# Altium schematic sheet CAN_PHY.SchDoc
size A3; Organization: Altium Limited; Address1: L3, 12a Rodborough Rd; Address2: Frenchs Forest; Address3: NSW; Address4: Australia 2086
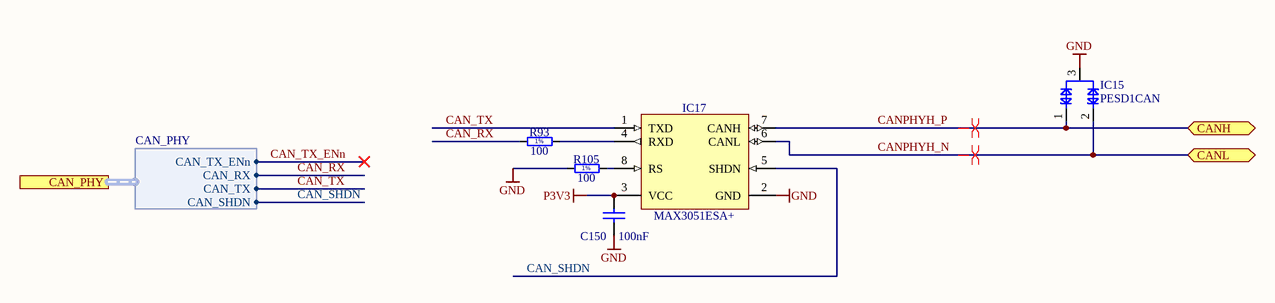
[diagram p0: CAN_PHY.SchDoc]

## Parts
C150  100nF  [CAPC1005X55N]
IC15  PESD1CAN  [SOT-23]
IC17  MAX3051ESA+  [SOIC127P600X175-8N]
R93  100  [RESC1005X40N]
R105  100  [RESC1005X40N]

## Ports
CAN_PHY (harness CAN_PHY), CANH (bidir), CANL (bidir)

## Harnesses
CAN_PHY: CAN_TX, CAN_RX, CAN_TX_ENn, CAN_SHDN

## Nets
GND: C150.1 IC15.3 IC17.2(GND) R105.1
P3V3: C150.2 IC17.3(VCC)
CAN_RX: R93.1 ; port CAN_PHY.CAN_RX
CAN_SHDN: IC17.5(SHDN) ; port CAN_PHY.CAN_SHDN
CAN_TX: IC17.1(TXD) ; port CAN_PHY.CAN_TX
CAN_TX_ENn: port CAN_PHY.CAN_TX_ENn
CANPHYH_N: IC15.2 IC17.6(CANL) ; port CANL
CANPHYH_P: IC15.1 IC17.7(CANH) ; port CANH
NetIC17_4: IC17.4(RXD) R93.2
NetIC17_8: IC17.8(RS) R105.2

## Layout directives
differential pair: CANPHYH_N, CANPHYH_P

## Notes on the sheet
- Title
- Size:
- Date:
- A3
- Number:
- Time:
- Revision:
- Sheet
- of
- File:
- (in symbol R0402_100R_1%_0.0625W_100PPM) 1%

## Library data of the parts
C150 = CC0402_100NF_16V_10%_X7R: Non-polarised capacitor; Part Description: SMD Multilayer Chip Ceramic Capacitor; Manufacturer: GENERIC; Manufacturer1 Part Number: GRM155R71C104KA88D; Voltage: 16V; TC: X7R; Tolerance: ±10%; Part Number: CC0402_100NF_16V_10%_X7R; Component Kind: Standard; Component Type: Standard; Pin Count: 2; Value: 100nF; Status: Not Recommended; Manufacturer Part Number: CC0402_100NF_16V_10%_X7R; Case: 0402; Mounted: Yes; Socket: No; SMD: Yes; Manufacturer1 Example: MURATA; Manufacturer1 ComponentHeight: 0.55mm; HelpURL: \\cern.ch\dfs\Applications\Altium\Datasheets\CC0402_X7R_MURATA_GRM.pdf; Author: CERN DEM JLC; CreateDate: 2013-12-05; LatestRevisionDate: 2007-12-03; Sense: No
IC15 = D_TVS_PESD1CAN: Dual 24V ESD transient voltage suppressor
IC17 = MAX3051ESA+: +3.3V, 1Mbps, Low-Supply-Current CAN Transceiver; Manufacturer: MAXIM; PressFit: No; Bonding: No; Part Number: MAX3051ESA+; Component Kind: Standard; Component Type: Standard; Device: MAX3051ESA+; PackageDescription: SOIC 8, Pitch 1.27mm - Body 4x5mm, IPC Medium Density; Part Description: +3.3V, 1Mbps, Low-Supply-Current CAN Transceiver; Manufacturer Part Number: MAX3051ESA+; Pin Count: 8; Case: SOIC8; Mounted: Yes; Socket: No; SMD: Yes; Sense: No; ComponentHeight: 1.75mm; Author: CERN DEM JLC; HelpURL: \\cern.ch\dfs\Applications\Altium\Datasheets\MAX3051ESA+.pdf; CreateDate: 2014-10-09; LatestRevisionDate: 2014-10-09
R93 R105 = R0402_100R_1%_0.0625W_100PPM: Resistor - 1%; Part Description: General Purpose Thick Film Chip Resistor; Manufacturer: GENERIC; Manufacturer1 Part Number: 232270671001L; TC: ±100ppm/°C; Table: Resistors SMD; Part Number: R0402_100R_1%_0.0625W_100PPM; Component Kind: Standard; Component Type: Standard; Pin Count: 2; Value: 100; Status: Not recommended; Power: 0.0625W; Tolerance: ±1%; Manufacturer Part Number: R0402_100R_1%_0.0625W_100PPM; Case: 0402; Mounted: Yes; Socket: No; SMD: Yes; Manufacturer1 Example: YAGEO PHYCOMP; Manufacturer1 ComponentHeight: 0.4mm; HelpURL: \\cern.ch\dfs\Applications\Altium\Datasheets\R0402_Phycomp_RC0402.pdf; Author: CERN DEM JLC; CreateDate: 2007-12-03; LatestRevisionDate: 2012-10-17